# Altium schematic sheet GPS.SchDoc: GPS
size A; Author: Micheal Burin; Revision: 1.0; SheetNumber: 9; SheetTotal: 10
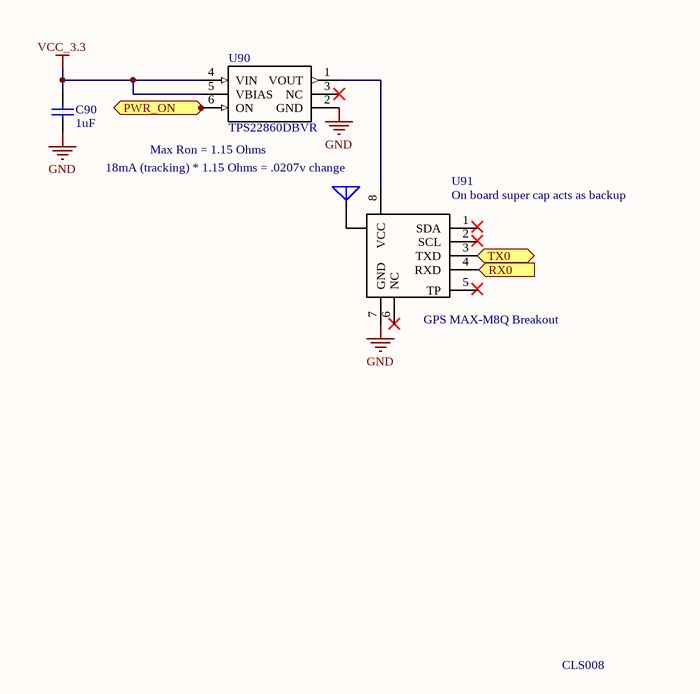
[diagram p0: GPS.SchDoc]

## Parts
C90  value 1uF  [0805_CHIP_FP]  (hidden comment: Capacitor_unpolarized_0603)
U90  TPS22860DBVR  [SOT95P279X145-6N]
U91  GPS MAX-M8Q Breakout  [HDR1X8]

## Ports
PWR_ON (in), RX0 (in), TX0 (out)

## Nets
GND: C90.2 U90.2(GND) U91.7(GND)
VCC_3.3: C90.1 U90.4(VIN) U90.5(VBIAS)
RX0: U91.4(RXD) ; port RX0
TX0: U91.3(TXD) ; port TX0
NetU90_1: U90.1(VOUT) U91.8(VCC)

Not connected (* = marked no-connect by the designer): U90 3(NC)* 6(ON); U91 1(SDA) 2(SCL) 5(TP) 6(NC) 9(A)

## Notes on the sheet
- (near U91) 18mA (tracking) * 1.15 Ohms = .0207v change
- (near U90) Max Ron = 1.15 Ohms
- (near U91) On board super cap acts as backup
- CLS008

## Library data of the parts
C90 = Capacitor_unpolarized_0603: Manufacturer: Samsung Electro-Mechanics; Manufacturer Part Number: CL21A105KOFNNNE; Vendor Part Number: 1276-2888-1-ND; Vendor: Digikey; Vendor Description: CAP CER 1UF 16V X5R 0805; ComponentLink1Description: Datasheet; ComponentLink1URL: https://www.digikey.com/product-detail/en/samsung-electro-mechanics/CL21A105KOFNNNE/1276-2888-1-ND/3890974; Cost: .10
U90 = TPS22860DBVR: TPS22860 Ultra-low leakage load switch 6-SOT-23 -40 to 85; Manufacturer: Texas Instruments; Vendor Part Number: 296-43982-1-ND; Vendor: Digikey; Vendor Description: IC SWITCH SPDT SOT23-6; Value: *; ComponentLink1Description: Datasheet; Cost: .84; Manufacturer Part Number: TPS22860DBVR; ComponentLink1URL: https://www.digikey.com/product-detail/en/texas-instruments/TPS22860DBVR/296-43982-1-ND/5973206
U91 = GPS MAX-M8Q Breakout: uBLOX MAX-M8Q GPS Breakout for Active; Manufacturer: Airspy; Manufacturer Part Number: UPU-uBLOX M8Q3A SMA; Vendor Description: uBLOX MAX-M8Q GPS Breakout for Active Antennas; ComponentLink1Description: Datasheet; ComponentLink1URL: https://v3.airspy.us/product/upu-ublox-m8q3a-sma/; Cost: 33.95; Vendor: Airspy; Vendor Part Number: UPU-uBLOX M8Q3A SMA